# EAGLE design snow_rev_B (EAGLE 5.11)

## Sheet 1 of 3
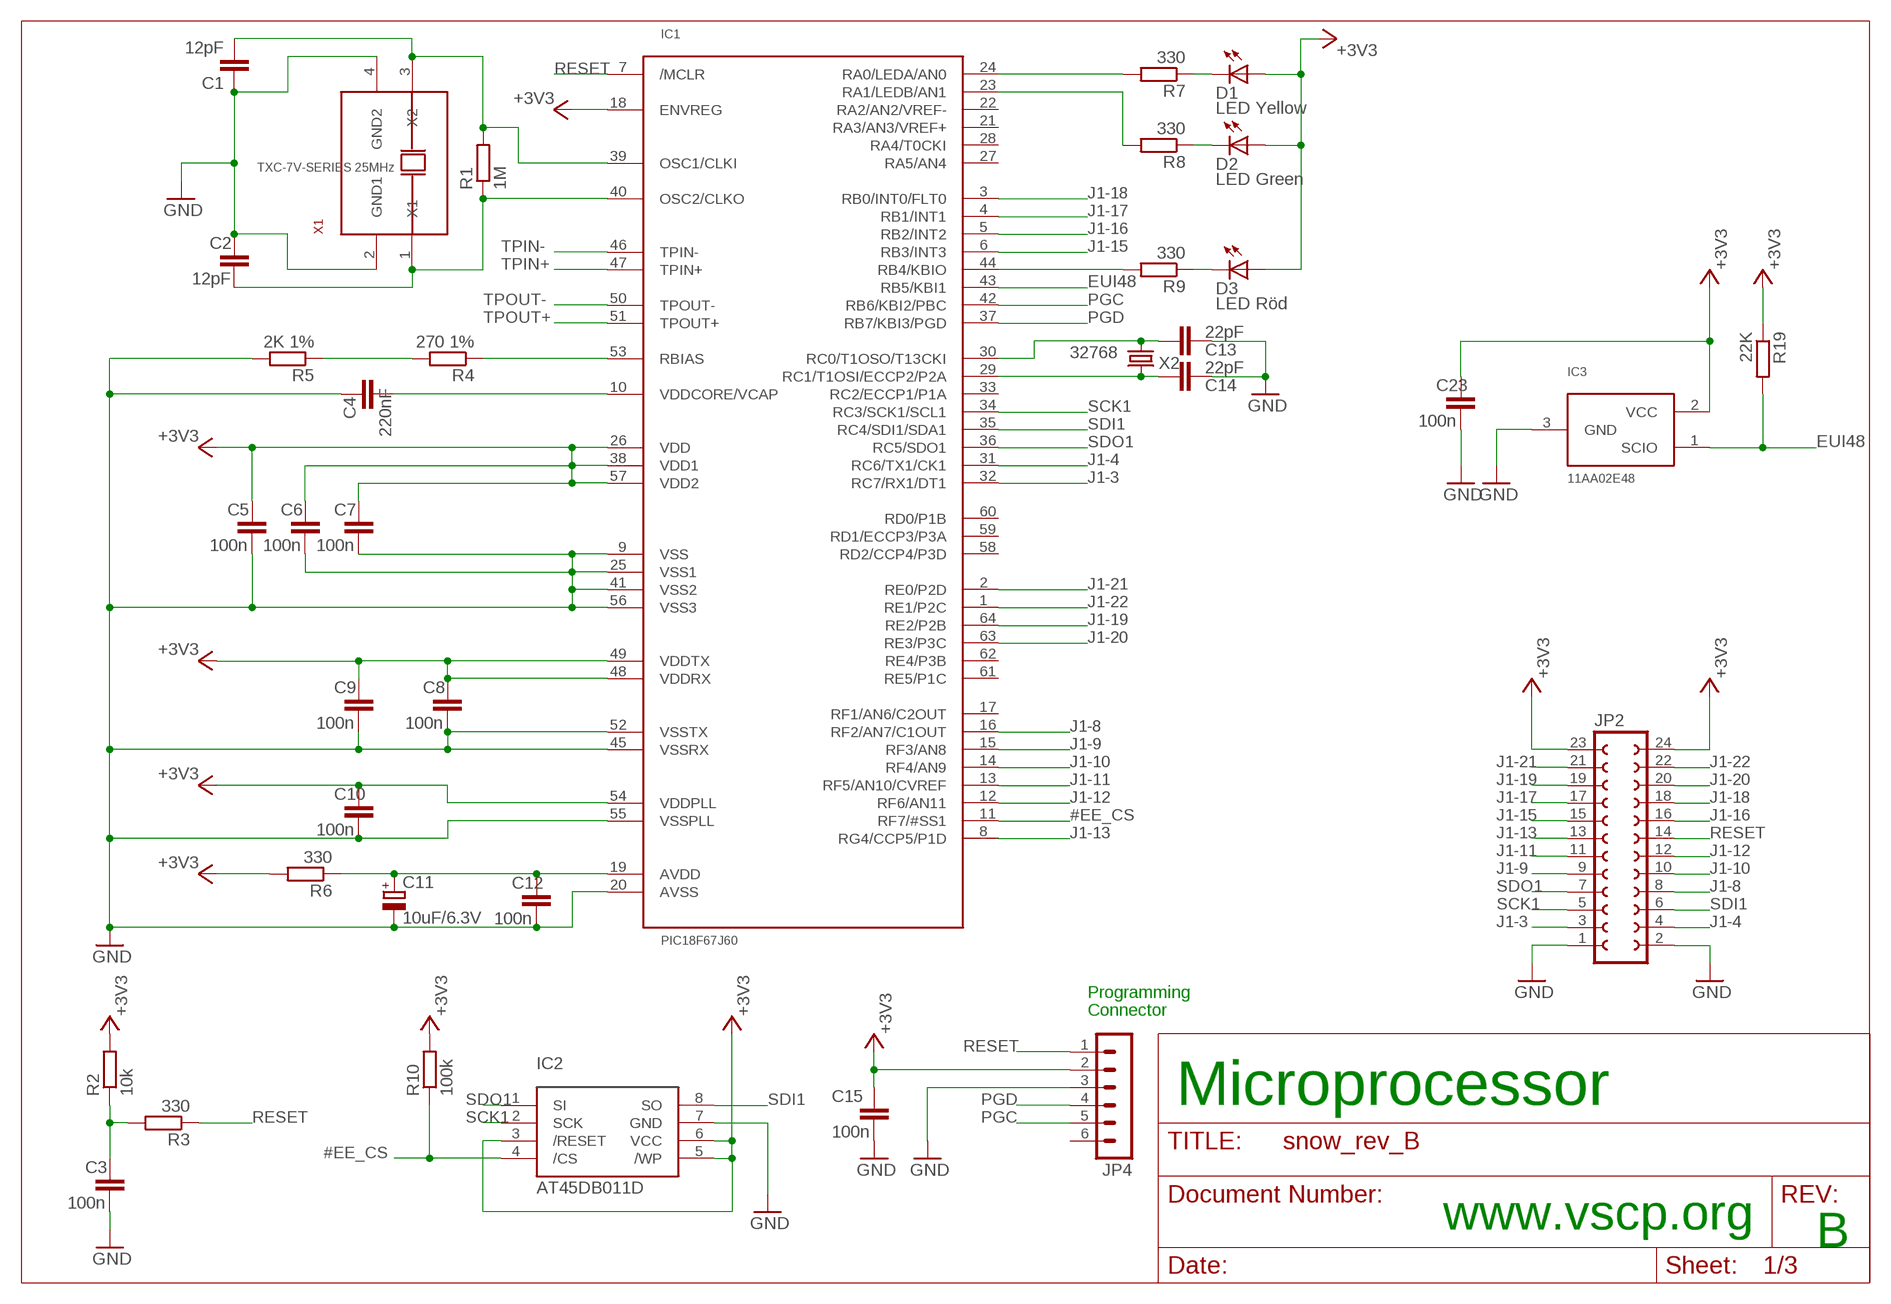
[diagram p0: schematic, sheet 1]

### Parts
C1  12pF  C-EUC0805  [C0805]
C2  12pF  C-EUC0805  [C0805]
C3  100n  C-EUC0805  [C0805]
C4  220nF  C-EUC0805  [C0805]
C5  100n  C-EUC0805  [C0805]
C6  100n  C-EUC0805  [C0805]
C7  100n  C-EUC0805  [C0805]
C8  100n  C-EUC0805  [C0805]
C9  100n  C-EUC0805  [C0805]
C10  100n  C-EUC0805  [C0805]
C11  10uF/6.3V  CPOL-EUSMCP  [SMC_P]
C12  100n  C-EUC0805  [C0805]
C13  22pF  C-EUC0805  [C0805]
C14  22pF  C-EUC0805  [C0805]
C15  100n  C-EUC0805  [C0805]
C23  100n  C-EUC0805  [C0805]
D1  LED Yellow  LED_2012  [C2012]
D2  LED Green  LED_2012  [C2012]
D3  LED Röd  LED_2012  [C2012]
IC1  PIC18F67J60  [TQFP64-10X10]
IC2  AT45DB011D  AT45DB011DSOP8W  [SOP8W]
IC3  11AA02E48  [SOT23]
JP2  FE12-2  [FE12-2]
JP4  MA06-1  [MA06-1]
R1  1M  R-EU_M0805  [M0805]
R2  10k  R-EU_M0805  [M0805]
R3  330  R-EU_M0805  [M0805]
R4  270 1%  R-EU_M0805  [M0805]
R5  2K 1%  R-EU_M0805  [M0805]
R6  330  R-EU_M0805  [M0805]
R7  330  R-EU_M0805  [M0805]
R8  330  R-EU_M0805  [M0805]
R9  330  R-EU_M0805  [M0805]
R10  100k  R-EU_M0805  [M0805]
R19  22K  R-EU_M0805  [M0805]
X1  TXC-7V-SERIES 25MHz  TXC-7V-SERIES  [TXC-7V-SERIES]
X2  32768  CRYSTALTC26H  [TC26H]

### Nets
#EE_CS: IC1.11(RF7/#SS1) IC2.4(/CS) R10.1
+3V3: C5.1 C6.1 C7.1 C8.1 C9.1 C10.1 C15.1 C23.1 D1.1(A) D2.1(A) D3.1(A) IC1.18(ENVREG) IC1.26(VDD) IC1.38(VDD1) IC1.48(VDDRX) IC1.49(VDDTX) IC1.54(VDDPLL) IC1.57(VDD2) IC2.3(/RESET) IC2.5(/WP) IC2.6(VCC) IC3.2(VCC) JP2.23 JP2.24 JP4.2 R2.2 R6.2 R10.2 R19.1 ; also sheet 2,3
EUI48: IC1.43(RB5/KBI1) IC3.1(SCIO) R19.2
GND: C1.1 C2.1 C3.2 C4.1 C5.2 C6.2 C7.2 C8.2 C9.2 C10.2 C11.- C12.2 C13.1 C14.1 C15.2 C23.2 IC1.9(VSS) IC1.20(AVSS) IC1.25(VSS1) IC1.41(VSS2) IC1.45(VSSRX) IC1.52(VSSTX) IC1.55(VSSPLL) IC1.56(VSS3) IC2.7(GND) IC3.3(GND) JP2.1 JP2.2 JP4.3 R5.2 X1.2(GND1) X1.4(GND2) ; also sheet 2,3
J1-3: IC1.32(RC7/RX1/DT1) JP2.3
J1-4: IC1.31(RC6/TX1/CK1) JP2.4
J1-8: IC1.16(RF2/AN7/C1OUT) JP2.8
J1-9: IC1.15(RF3/AN8) JP2.9
J1-10: IC1.14(RF4/AN9) JP2.10
J1-11: IC1.13(RF5/AN10/CVREF) JP2.11
J1-12: IC1.12(RF6/AN11) JP2.12
J1-13: IC1.8(RG4/CCP5/P1D) JP2.13
J1-15: IC1.6(RB3/INT3) JP2.15
J1-16: IC1.5(RB2/INT2) JP2.16
J1-17: IC1.4(RB1/INT1) JP2.17
J1-18: IC1.3(RB0/INT0/FLT0) JP2.18
J1-19: IC1.64(RE2/P2B) JP2.19
J1-20: IC1.63(RE3/P3C) JP2.20
J1-21: IC1.2(RE0/P2D) JP2.21
J1-22: IC1.1(RE1/P2C) JP2.22
N$3: C1.2 IC1.39(OSC1/CLKI) R1.2 X1.3(X2)
N$4: C2.2 IC1.40(OSC2/CLKO) R1.1 X1.1(X1)
N$5: IC1.53(RBIAS) R4.1
N$6: R4.2 R5.1
N$7: C14.2 IC1.29(RC1/T1OSI/ECCP2/P2A) X2.2
N$8: C3.1 R2.1 R3.2
N$9: C4.2 IC1.10(VDDCORE/VCAP)
N$10: C13.2 IC1.30(RC0/T1OSO/T13CKI) X2.1
N$11: IC1.24(RA0/LEDA/AN0) R7.2
N$12: IC1.23(RA1/LEDB/AN1) R8.2
N$13: IC1.44(RB4/KBIO) R9.2
N$14: D3.2(C) R9.1
N$15: D2.2(C) R8.1
N$16: D1.2(C) R7.1
N$23: C11.+ C12.1 IC1.19(AVDD) R6.1
PGC: IC1.42(RB6/KBI2/PBC) JP4.5
PGD: IC1.37(RB7/KBI3/PGD) JP4.4
RESET: IC1.7(/MCLR) JP2.14 JP4.1 R3.1
SCK1: IC1.34(RC3/SCK1/SCL1) IC2.2(SCK) JP2.5
SDI1: IC1.35(RC4/SDI1/SDA1) IC2.8(SO) JP2.6
SDO1: IC1.36(RC5/SDO1) IC2.1(SI) JP2.7
TPIN+: IC1.47(TPIN+) ; also sheet 3
TPIN-: IC1.46(TPIN-) ; also sheet 3
TPOUT+: IC1.51(TPOUT+) ; also sheet 3
TPOUT-: IC1.50(TPOUT-) ; also sheet 3
Unconnected: IC1.17(RF1/AN6/C2OUT) IC1.21(RA3/AN3/VREF+) IC1.22(RA2/AN2/VREF-) IC1.27(RA5/AN4) IC1.28(RA4/T0CKI) IC1.33(RC2/ECCP1/P1A) IC1.58(RD2/CCP4/P3D) IC1.59(RD1/ECCP3/P3A) IC1.60(RD0/P1B) IC1.61(RE5/P1C) IC1.62(RE4/P3B) JP4.6

### Notes on the sheet
- Programming
- Connector
- Microprocessor
- www.vscp.org
- B

## Sheet 2 of 3
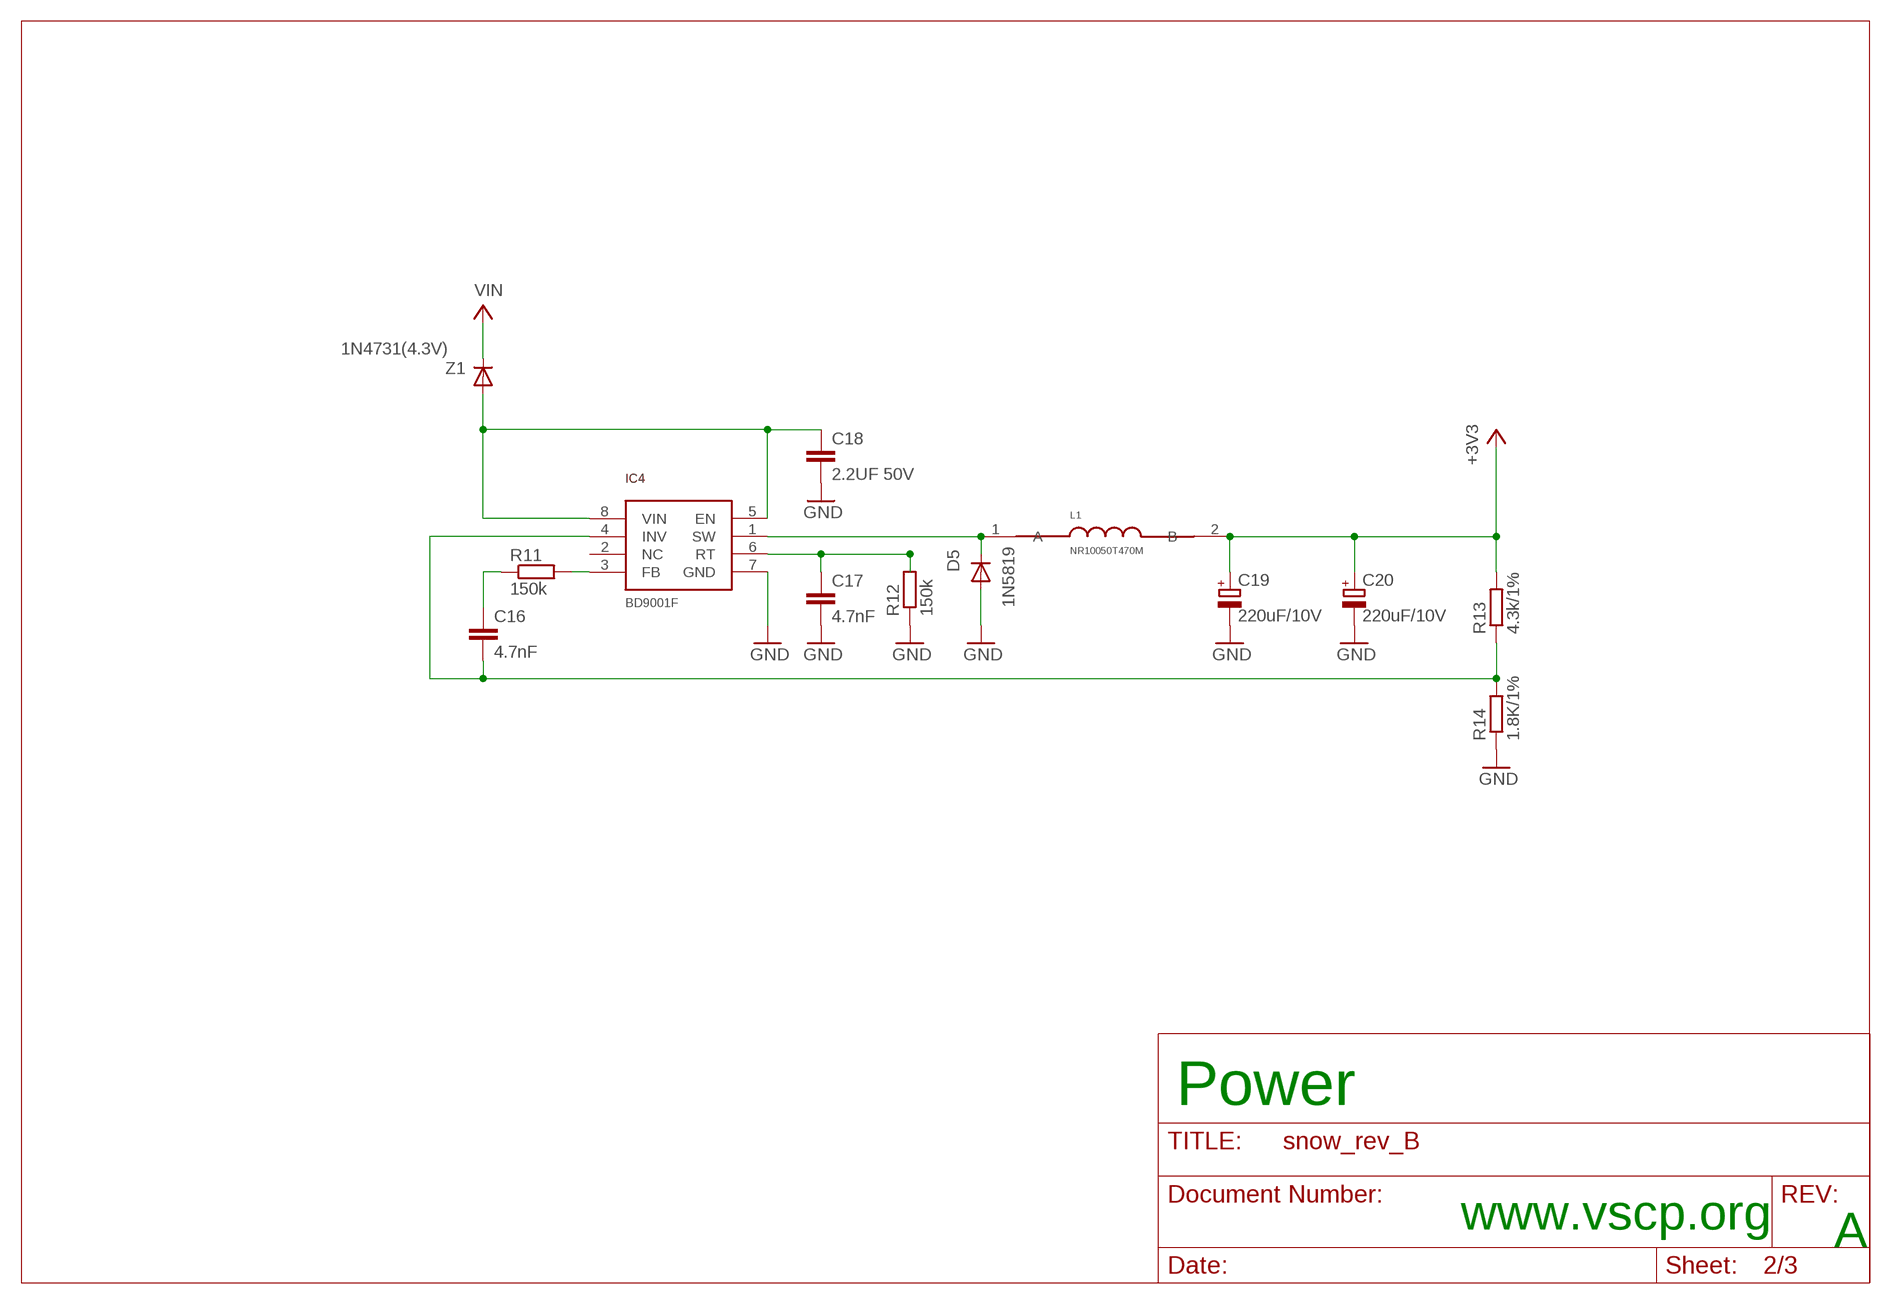
[diagram p1: schematic, sheet 2]

### Parts
C16  4.7nF  C-EUC0805  [C0805]
C17  4.7nF  C-EUC0805  [C0805]
C18  2.2UF 50V  C-EUC2012  [C2012]
C19  220uF/10V  CPOL-EUSMCC  [SMC_C]
C20  220uF/10V  CPOL-EUSMCC  [SMC_C]
D5  1N5819  [SOD-123]
IC4  BD9001F  [SOP8]
L1  NR10050T470M  [NR10050T470M]
R11  150k  R-EU_M0805  [M0805]
R12  150k  R-EU_M0805  [M0805]
R13  4.3k/1%  R-EU_M0805  [M0805]
R14  1.8K/1%  R-EU_M0805  [M0805]
Z1  1N4731(4.3V)  [1N4731]

### Nets
+3V3: C19.+ C20.+ L1.2(B) R13.2 ; also sheet 1,3
GND: C17.2 C18.2 C19.- C20.- D5.A IC4.7(GND) R12.1 R14.1 ; also sheet 1,3
N$17: IC4.3(FB) R11.2
N$18: C16.1 R11.1
N$19: C16.2 IC4.4(INV) R13.1 R14.2
N$20: C17.1 IC4.6(RT) R12.2
N$21: C18.1 IC4.5(EN) IC4.8(VIN) Z1.A
N$22: D5.C IC4.1(SW) L1.1(A)
V+: Z1.C ; supply symbol labelled VIN ; also sheet 3
Unconnected: IC4.2(NC)

### Notes on the sheet
- Power
- www.vscp.org
- A

## Sheet 3 of 3
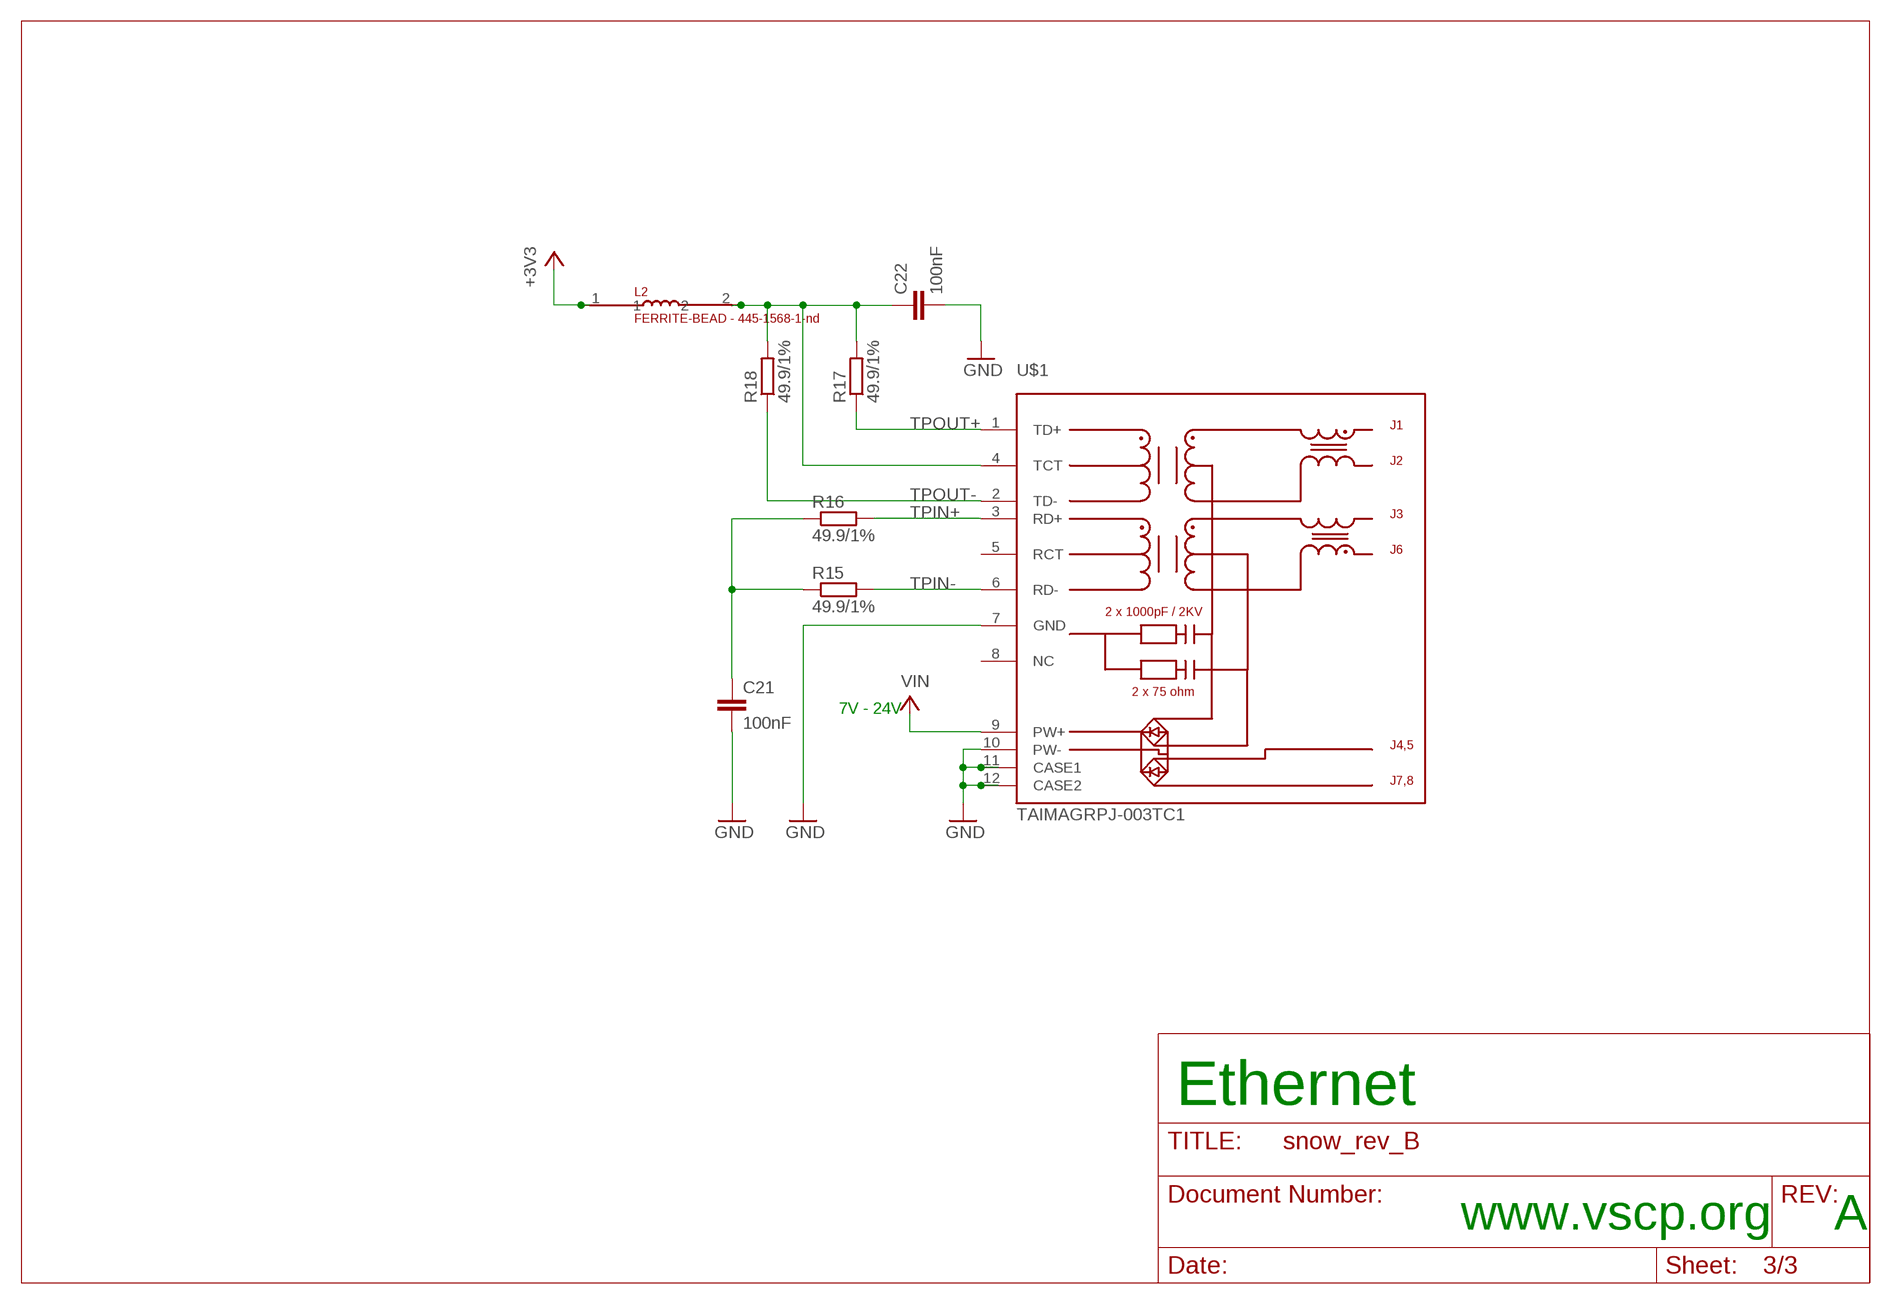
[diagram p2: schematic, sheet 3]

### Parts
C21  100nF  C-EUC0805  [C0805]
C22  100nF  C-EUC0805  [C0805]
L2  FERRITE-BEAD - 445-1568-1-nd  FERRITE-BEAD  [0805]
R15  49.9/1%  R-EU_M0805  [M0805]
R16  49.9/1%  R-EU_M0805  [M0805]
R17  49.9/1%  R-EU_M0805  [M0805]
R18  49.9/1%  R-EU_M0805  [M0805]
U$1  TAIMAGRPJ-003TC1  [TAIMAGRJP-003TC1]

### Nets
+3V3: L2.1 ; also sheet 1,2
GND: C21.2 C22.2 U$1.7(GND) U$1.10(PW-) U$1.11(CASE1) U$1.12(CASE2) ; also sheet 1,2
N$27: C21.1 R15.1 R16.1
N$31: C22.1 L2.2 R17.2 R18.2 U$1.4(TCT)
TPIN+: R16.2 U$1.3(RD+) ; also sheet 1
TPIN-: R15.2 U$1.6(RD-) ; also sheet 1
TPOUT+: R17.1 U$1.1(TD+) ; also sheet 1
TPOUT-: R18.1 U$1.2(TD-) ; also sheet 1
V+: U$1.9(PW+) ; supply symbol labelled VIN ; also sheet 2
Unconnected: U$1.5(RCT) U$1.8(NC)

### Notes on the sheet
- 7V - 24V
- Ethernet
- www.vscp.org | A

## Library data of the parts
C1-C10 C12-C18 C21-C23 = rcl:C-EU: CAPACITOR, European symbol
C11 C19 C20 = rcl:CPOL-EU: POLARIZED CAPACITOR, European symbol
D1-D3 = snow:LED_2012
D5 = snow:1N5819
IC1 = snow:PIC18F67J60
IC2 = snow:AT45DB011D
IC3 = snow:11AA02E48
IC4 = snow:BD9001F
JP2 = con-lsta:FE12-2: FEMALE HEADER; OC_FARNELL: unknown; OC_NEWARK: unknown
JP4 = con-lstb:MA06-1: PIN HEADER; OC_FARNELL: unknown; OC_NEWARK: unknown
L1 = snow:NR10050T470M
L2 = snow:FERRITE-BEAD
R1-R19 = rcl:R-EU_: RESISTOR, European symbol
U$1 = snow:TAIMAGRPJ-003TC1
X1 = snow:TXC-7V-SERIES
X2 = crystal:CRYSTAL: CRYSTAL; OC_FARNELL: unknown; OC_NEWARK: unknown
Z1 = snow:1N4731(4.3V)

## Board
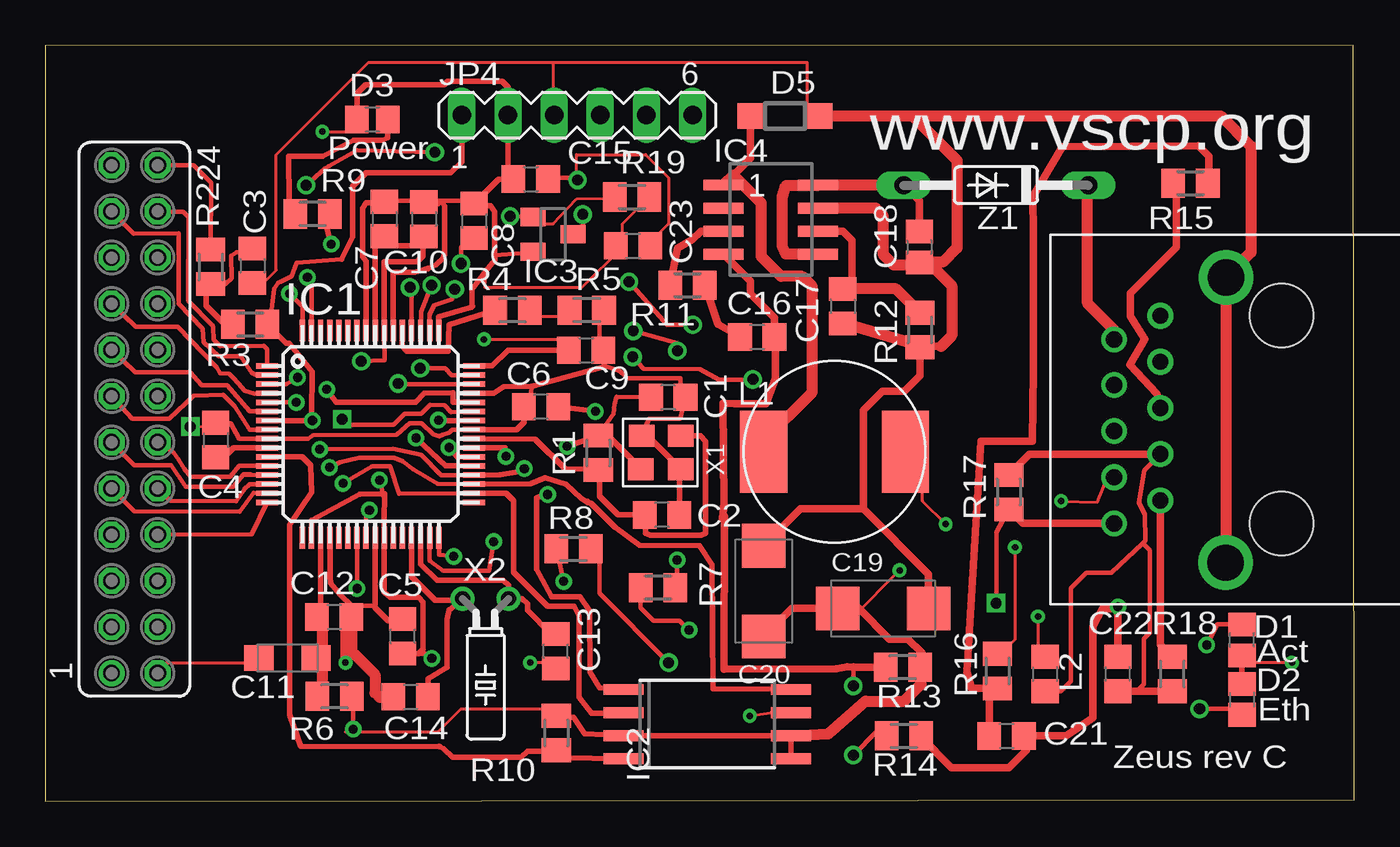
[diagram p3: board, top side]
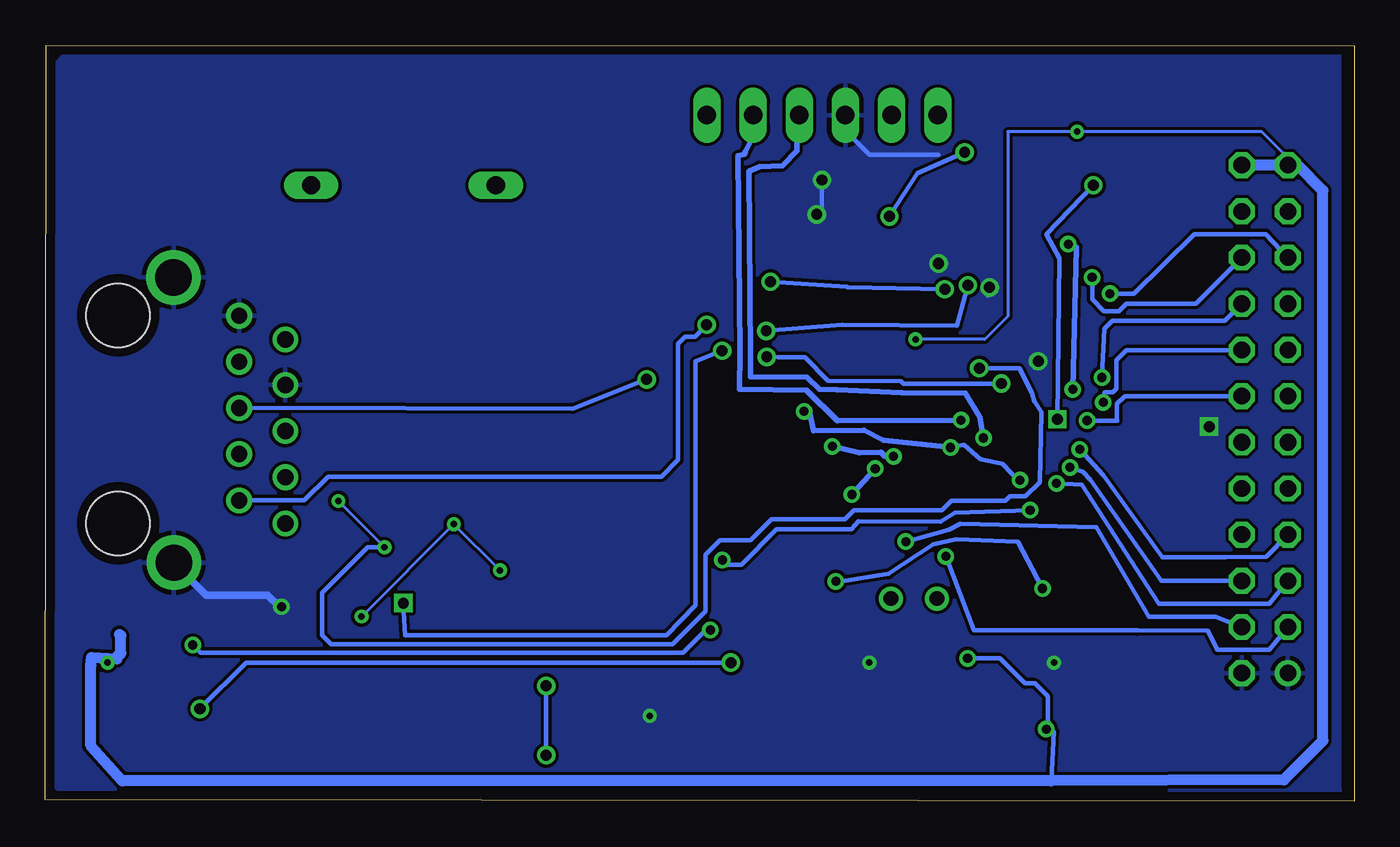
[diagram p4: board, bottom side, seen from below]

Size 72 x 41.57 mm. Coordinates in mm from the lower left corner, seen from the top.
Outline: 0,0 72,0.08 71.95,41.57 0,41.54 0,0
Copper layers (1*16): Top 0.0356mm / dielectric 1.5011mm / Bottom 0.0356mm
Design rules "SilverCircuits": minimum track width 7mil, minimum drill 14mil, track to track 7mil, track to pad 7mil, pad to pad 7mil, via to via 7mil, smd to smd 0mil, copper to edge 20mil, drill to drill 8mil, minimum pad ring 10mil, minimum via ring 8mil, stop-mask expansion 4mil, vias tented up to drill 0mil, thermal gap 10mil

### Footprints (pad centres in the part's own frame; a part is rotated, then mirrored left to right if it is on the bottom)
C0805 = smd 1.3 x 1.5: 1 -0.95,0; 2 0.95,0
SMC_P = smd 1.6 x 1.4: + -1.575,0; - 1.575,0
C2012 = smd 1.3 x 1.5: 1 -0.85,0; 2 0.85,0
SMC_C = smd 2.4 x 2.4: + -2.5,0; - 2.5,0
SOD-123 = smd 1.4 x 1.4: A 1.9,0; C -1.9,0
TQFP64-10X10 = smd 1.2 x 0.3: 1 -5.7,3.75; 2 -5.7,3.25; 3 -5.7,2.75; 4 -5.7,2.25; 5 -5.7,1.75; 6 -5.7,1.25; 7 -5.7,0.75; 8 -5.7,0.25; 9 -5.7,-0.25; 10 -5.7,-0.75; 11 -5.7,-1.25; 12 -5.7,-1.75; 13 -5.7,-2.25; 14 -5.7,-2.75; 15 -5.7,-3.25; 16 -5.7,-3.75; 33 5.7,-3.75; 34 5.7,-3.25; 35 5.7,-2.75; 36 5.7,-2.25; 37 5.7,-1.75; 38 5.7,-1.25; 39 5.7,-0.75; 40 5.7,-0.25; 41 5.7,0.25; 42 5.7,0.75; 43 5.7,1.25; 44 5.7,1.75; 45 5.7,2.25; 46 5.7,2.75; 47 5.7,3.25; 48 5.7,3.75 | smd 0.3 x 1.2: 17 -3.75,-5.7; 18 -3.25,-5.7; 19 -2.75,-5.7; 20 -2.25,-5.7; 21 -1.75,-5.7; 22 -1.25,-5.7; 23 -0.75,-5.7; 24 -0.25,-5.7; 25 0.25,-5.7; 26 0.75,-5.7; 27 1.25,-5.7; 28 1.75,-5.7; 29 2.25,-5.7; 30 2.75,-5.7; 31 3.25,-5.7; 32 3.75,-5.7; 49 3.75,5.7; 50 3.25,5.7; 51 2.75,5.7; 52 2.25,5.7; 53 1.75,5.7; 54 1.25,5.7; 55 0.75,5.7; 56 0.25,5.7; 57 -0.25,5.7; 58 -0.75,5.7; 59 -1.25,5.7; 60 -1.75,5.7; 61 -2.25,5.7; 62 -2.75,5.7; 63 -3.25,5.7; 64 -3.75,5.7
SOP8W = smd 2.2 x 0.6: 1 -4.6,1.905; 2 -4.6,0.635; 3 -4.6,-0.635; 4 -4.6,-1.905; 5 4.6,-1.905; 6 4.6,-0.635; 7 4.6,0.635; 8 4.6,1.905
SOT23 = smd 1 x 1.4: 1 -0.95,-1.1; 2 0.95,-1.1; 3 0,1.1
SOP8 = smd 0.6 x 2.2: 1 -1.905,-2.6; 2 -0.635,-2.6; 3 0.635,-2.6; 4 1.905,-2.6; 5 1.905,2.6; 6 0.635,2.6; 7 -0.635,2.6; 8 -1.905,2.6
FE12-2 = drill 0.914: 1 -13.97,1.27 | drill 0.914 octagon: 2 -13.97,-1.27; 3 -11.43,1.27; 4 -11.43,-1.27; 5 -8.89,1.27; 6 -8.89,-1.27; 7 -6.35,1.27; 8 -6.35,-1.27; 9 -3.81,1.27; 10 -3.81,-1.27; 11 -1.27,1.27; 12 -1.27,-1.27; 13 1.27,1.27; 14 1.27,-1.27; 15 3.81,1.27; 16 3.81,-1.27; 17 6.35,1.27; 18 6.35,-1.27; 19 8.89,1.27; 20 8.89,-1.27; 21 11.43,1.27; 22 11.43,-1.27; 23 13.97,1.27; 24 13.97,-1.27
MA06-1 = drill 1.016 long: 1 -6.35,0; 2 -3.81,0; 3 -1.27,0; 4 1.27,0; 5 3.81,0; 6 6.35,0
NR10050T470M = smd 2.6 x 4.5: 1 -3.9,0; 2 3.9,0
0805 = smd 1.3 x 1.5: 1 -0.95,0; 2 0.95,0
M0805 = smd 1.3 x 1.6: 1 -0.95,0; 2 0.95,0
TAIMAGRJP-003TC1 = drill 0.9: 1 -5.72,9.2; 2 -4.45,6.66; 3 -3.18,9.2; 4 -1.91,6.66; 5 -0.64,9.2; 6 0.63,6.66; 7 1.9,9.2; 8 3.17,6.66; 9 4.4,9.2; 10 5.7,6.66 | drill 2: 11 -7.88,3.07; 12 7.81,3.05 | hole 3.5: -5.72,0; 5.72,0
TXC-7V-SERIES = smd 1.4 x 1.2: 1 -1.07,-0.67; 2 1.07,-0.67; 3 1.13,1.17; 4 -1.07,1.17
TC26H = drill 0.813: 1 -1.27,0; 2 1.27,0
1N4731 = drill 1 long: A 5.08,0; C -5.08,0

### Placement (x,y rotation side)
C1  34.27,22.21 180 top
C2  33.92,15.75 180 top
C3  11.39,29.45 270 top
C4  9.37,19.87 270 top
C5  19.65,9.07 90 top
C6  27.27,21.69 180 top
C7  18.65,32.02 270 top
C8  23.59,31.92 270 top
C9  29.75,24.81 0 top
C10  20.82,32.01 270 top
C11  13.32,7.88 180 top
C12  15.89,10.14 0 top
C13  28.08,8.25 90 top
C14  20.09,5.74 0 top
C15  26.7,34.22 0 top
C16  39.16,25.54 0 top
C17  43.87,27.23 270 top
C18  48.08,30.48 270 top
C19  46.09,10.6 0 top
C20  39.52,11.56 90 top
C21  52.88,3.59 0 top
C22  59,7 90 top
C23  32.32,30.55 0 top
D1  65.83,8.87 90 top
D2  65.83,5.6 270 top
D3  17.99,37.5 0 top
D5  40.69,37.69 0 top
IC1  17.89,20.19 0 top
IC2  36.41,4.24 0 top
IC3  27.93,31.18 270 top
IC4  39.91,31.99 270 top
JP2  4.91,21.01 90 top
JP4  29.25,37.73 0 top
L1  43.42,19.22 0 top
L2  55,7 270 top
R1  30.42,19.16 90 top
R2  9.09,29.39 90 top
R3  11.26,26.22 180 top
R4  25.69,27 0 top
R5  29.79,27.01 0 top
R6  15.9,5.77 0 top
R7  33.7,11.75 0 top
R8  29.05,13.88 180 top
R9  14.7,32.3 0 top
R10  28.11,3.75 90 top
R11  35.33,28.39 180 top
R12  48.12,25.92 90 top
R13  47.17,7.36 0 top
R14  47.23,3.59 180 top
R15  63,34 180 top
R16  52.38,7.16 90 top
R17  53,17 90 top
R18  62,7 270 top
R19  32.27,33.23 180 top
U$1  68,21 90 top
X1  33.89,19.43 180 top
X2  24.21,11.15 180 top
Z1  52.3,33.88 180 top

### Tracks (layer width: path | path; a pad name or v marks a point on that pad's centre or on a via)
#EE_CS
  Top 0.305: IC2.4 28.35,2.39 R10.1 28.11,2.77 28.09,2.75 26.53,2.75 26.18,2.41 22.41,2.41 21.92,2.9 21.67,3.02 21.7,3 14.04,3.02 13.42,4.75 13.42,15.19 14.64,16.98 14.58,18.47 14.12,18.93 IC1.11
+3V3  (via drill 0.36, 0.5)
  Top 0.178: R10.2 27.94,5.08 22.86,5.08 21.59,3.81 16.51,3.81 v16.94,3.97 | 26.54,30.16 IC3.2 | C8.1 24,32.7 | 31.75,30.48 31.75,31.75 33.02,33.02 R19.1 | 31.75,30.48 29.52,28.27 24.17,28.27 24.2,29.14 | 31.75,30.48 C23.1 | v54.61,10.16 54.61,7.62 L2.1 | v49.53,15.24 48.26,16.51 48.26,19.05 L1.2 | v68.58,7.62 66.04,7.62 D1.1 | v15.24,36.83 16.51,36.83 D3.1 | v24.13,25.4 29.21,25.4 C9.1 | v46.99,12.7 44.45,10.16 C19.+
  Top 0.254: R2.2 9.12,34.01 8.15,34.98 JP2.24 | C5.1 21,8.12 v21.26,7.86 | v16.94,3.97 16.94,5.69 R6.2 | v18.38,17.66 18.63,16.68 18.66,16.9 | C7.1 19.05,33.02 20.32,33.02 C10.1 | 21.59,32.96 21.59,33.02 22.86,33.02 C8.1 | 24.71,30.04 26.54,30.16
  Top 0.305: IC1.57 17.64,29.69 17.46,29.94 17.46,32.62 17.66,32.92 18.59,32.92 C7.1 | 21.51,32.96 21.59,32.96 21.82,32.96 21.96,32.74 21.97,30.08 21.88,29.86 21.48,29.5 21.05,29.29 21.05,29.32 20.31,29.1 19.14,29.1 19.13,28.61 19.13,25.93 IC1.54 | 21.51,32.96 C10.1 | IC1.49 21.62,26.63 23.34,27.14 23.45,27.17 23.45,27.23 23.49,27.23 23.47,27.21 23.47,28.17 24.2,29.14 24.73,29.78 24.71,30.04 24.71,32.41 24.5,32.76 23.7,32.76 C8.1 24.94,34.22 C15.1 25.44,34.53 JP4.2 25.46,37.75 25.46,39.26 25.11,39.61 22.14,39.61 21.93,39.4 17.61,39.4 17.14,38.93 D3.1 | IC1.48 24.58,23.94 25.46,24.82 C9.1 | IC1.38 22.64,18.94 v22.21,19.46 | v30.26,21.45 C6.1 | C5.1 20.52,8.12 20.77,8.37 20.77,10.96 20.52,11.21 18.96,11.21 18.63,11.49 18.63,14.48 IC1.26 18.64,15.44 18.66,16.9 17.28,16.88 14.64,15.45 IC1.18 | R10.2 28.2,4.61 29.06,4.61 29.67,3.71 IC2.3 IC2.6 IC2.5 | 21.51,32.96 21.61,32.87 | D1.1 D2.1 | D1.1 | 48.18,6.44 48.18,7.3 R13.2
  Top 0.406: 48.09,7.39 R13.2 48.21,7.45 48.21,8.18 47.47,8.92 46.44,8.92 44.76,10.6 C19.+ 41.06,10.6 C20.+
  Top 0.61: IC2.6 43.08,3.71 45.12,5.5 47.24,5.5 48.18,6.44
  Bottom 0.178: v54.61,10.16 v49.53,15.24 v46.99,12.7 | 68.57,7.86 v68.58,7.62 | JP2.23 3.81,35.56 5.08,36.83 v15.24,36.83 19.05,36.83 19.05,26.67 20.32,25.4 v24.13,25.4
  Bottom 0.254: v21.26,7.86 19.49,7.86 18.11,6.48 17.56,6.48 R6.2 16.86,4.05 v16.94,3.97 16.51,3.81 16.66,1.12 | v22.21,19.46 21.45,19.6 20.55,18.81 19.34,18.56 18.31,17.45 v18.38,17.66
  Bottom 0.305: v22.21,19.46 25.91,19.85 26.97,20.41 29.73,20.38 29.96,21.45 29.94,21.44 v30.26,21.45
  Bottom 0.61: JP2.24 JP2.23 3.11,34.98 1.71,33.59 1.71,3.33 3.87,1.17 16.66,1.12 67.76,1.12 69.5,3.06 69.5,7.47 69.46,7.91 68.57,7.86 68.06,7.83 68.06,7.95 67.96,8.05 67.94,8.05 67.88,8.11 67.88,8.12 67.86,8.15 67.86,9.11 67.93,9.18
EUI48  (via drill 0.6)
  Top 0.178: IC3.1 26.67,31.75 27.94,31.75 29.23,33.13 31.76,33.16 R19.2
  Top 0.254: IC1.43 22.32,21.41 21.95,21.77 21.17,21.81 20.67,21.31 19.76,21.31 19.15,20.7 16.63,20.7 v16.32,21 | v14.34,33.88 15.39,34.82 15.59,34.92 17.15,35.8 v21.42,35.69 | v25.56,32.17 IC3.1
  Bottom 0.254: v16.32,21 16.22,29.87 16.92,31.17 v14.34,33.88 | v21.42,35.69 24.02,34.55 v25.56,32.17
GND  (via drill 0.36, 0.5, 0.6, 0.61)
  Top 0.178: C12.2 16.51,10.16 | 27.94,40.64 17.78,40.64 12.7,35.56 12.7,29.21 11.43,27.94 C3.2 | 27.94,40.64 27.94,38.1 JP4.3 | C23.2 33.02,30.48 34.29,31.75 34.29,34.29 33.02,35.56 29.21,35.56 29.21,34.29 v29.28,34.17 | 27.94,40.64 41.91,40.64 41.91,38.1 D5.A | v26.67,7.62 27.94,7.62 C13.1 | C11.- 11.43,7.62 6.35,7.62 JP2.2 | v38.75,4.7 39.9,4.87 IC2.7 | C4.1 8.81,20.56 v7.97,20.61
  Top 0.254: X1.2 33.21,21.04 34.91,21.04 34.95,21.08 C1.1 34.9,22.21 34.95,23.28 32.04,23.28 31.92,23.37 31.61,23.64 31.56,23.69 30.89,23.89 30.73,23.89 | 16.84,10.74 18.13,10.74 18.14,10.72 | 16.84,8.07 17.03,8.07 | 18.39,5.69 19.09,5.69 C14.1 | C4.1 9.36,20.78 10.18,20.78 10.64,19.94 IC1.9 14.46,19.94 14.73,20.13 19.33,20.14 20.05,20.8 20.7,20.8 21.33,20.17 21.66,20.07 21.86,20.16 22.2,20.26 22.37,20.43 23.57,20.42 IC1.41 | C9.2 30.48,25.4 30.48,26.67 R5.2 | 26.73,22.82 26.67,21.59 C6.2 | v22.86,29.58 22.86,30.48 C8.2 | C15.2 27.94,34.29 29.16,34.29 v29.28,34.17 | v29.57,32.28 29.57,31.72 IC3.3 | IC1.52 20.14,27.75 v20.06,28.26 | IC1.55 18.65,24.26 17.31,24.2 v17.38,24.2
  Top 0.305: C2.1 34.87,18.18 X1.4 33.12,20.1 X1.2 | 18.14,30.56 IC1.56 | 18.14,30.56 C7.2 | IC1.55 18.64,25.57 18.63,25.53 18.63,28.85 18.62,29.68 20.45,29.68 20.78,30 20.78,31.02 C10.2 | IC1.41 25.92,20.44 26.33,20.85 C6.2 | IC1.45 24.67,22.44 25.2,22.8 26.73,22.82 26.89,22.85 30.73,23.89 30.73,24.78 C9.2 | IC1.25 18.14,10.72 18.14,10.63 18.84,9.93 19.57,9.93 C5.2 | C12.2 16.84,10.74 16.21,11.37 15.7,11.99 15.66,12.37 15.66,14.47 IC1.20 | C10.2 20.91,30.97 | 18.14,30.56 20.32,30.56 C10.2 | JP4.3 28,37.75
  Top 0.406: C22.2 v59,10.69 v59.01,10.7 58.89,10.59 58.16,10.59 57.63,9.59 57.63,4.59 56.16,3.59 C21.2 53.97,3.46 53.97,2.81 53.01,1.85 49.86,1.85 48.18,3.53 R14.1 | 47.93,29.48 C18.2 48.59,29.63 48.61,29.65 | 49.29,25.02 48.17,25.02 R12.1 | R12.1 48.01,25.07 | D5.A 47.71,37.69 | 45,16.09 45,21.5 46.05,22.55 47.25,22.55 48.1,23.4 48.1,24.95 R12.1 | 45,16.09 41.55,16.09 C20.- | C19.- 48.59,12.49 45,16.09
  Top 0.61: U$1.11 U$1.12 66.33,30.19 66.33,36.03 64.67,37.69 D5.A | IC4.7 45.67,32.62 46.1,32.2 46.1,30.07 46.68,29.48 47.93,29.48 | 48.59,29.63 49.87,28.36 49.87,25.6 49.29,25.02 | 48.01,25.07 C17.2 | 47.71,37.69 50.15,35.24 50.15,30.43 49.37,29.65 48.61,29.65 | C12.2 16.84,8.07 | 17.03,8.07 18.13,6.96 18.13,5.95 18.39,5.69 | 16.51,10.16 v16.51,7.62
  Bottom 0.254: 22.86,35.56 26.67,35.56 27.94,36.83 JP4.3 | v29.28,34.17 29.28,32.56 v29.57,32.28 | v20.06,28.26 20.15,27.8 20.16,27.82 | v17.38,24.2 17.39,24.16
  Bottom 0.406: v59.01,10.7 59.12,10.7 59.76,11.33 63.14,11.33 U$1.11
  pour Bottom: 0.82,41.27 0.82,0.67 0.75,0.6 71.25,0.6 71.55,0.9 71.55,40.44 70.88,41.11 1.05,41.11
J1-3  (via drill 0.5)
  Top 0.254: IC1.32 21.66,13.55 v22.46,13.47
  Bottom 0.254: v22.46,13.47 20.92,9.41 11.93,9.4 8.04,9.39 7.51,8.33 4.66,8.33 JP2.3
J1-4  (via drill 0.5)
  Top 0.254: v24.66,14.28 24.41,12.69 21.88,12.69 21.13,13.23 IC1.31
  Bottom 0.254: JP2.4 7.62,10.16 11.29,10.15 14.19,15.07 21.66,15.25 22.28,14.93 v24.66,14.28
J1-8
  Top 0.254: IC1.16 11.34,14.69 JP2.8
J1-9
  Top 0.254: IC1.15 11.45,16.96 10.7,15.93 4.88,15.95 JP2.9
J1-10
  Top 0.254: IC1.14 11.23,17.44 10.94,17.16 10.94,17.13 10.51,16.5 6.85,16.53 JP2.10
J1-11
  Top 0.254: IC1.13 10.94,17.96 11.29,17.98 10.92,17.98 10.33,17.28 7.71,17.28 6.92,18.49 4.89,18.49 JP2.11
J1-12
  Top 0.254: IC1.12 10.67,18.44 10.17,17.85 8,17.85 7.63,18.3 7.32,18.79 7.04,19.15 6.2,19.73 JP2.12
J1-13
  Top 0.254: IC1.8 11.23,20.43 10.4,21.73 10.05,22.07 9.78,22.35 8.15,22.29 6.82,21.04 4.77,21.05 JP2.13
J1-15
  Top 0.254: IC1.6 11.23,21.45 9.99,22.89 8.6,22.89 7.97,23.58 4.95,23.58 JP2.15
J1-16  (via drill 0.5)
  Top 0.254: IC1.5 13.73,21.94 v13.8,21.93
  Bottom 0.254: v13.8,21.93 13.74,22.47 13.7,22.5 13.27,22.5 13.09,22.68 13.09,24.25 12.54,24.8 6.2,24.8 JP2.16
J1-17
  Top 0.254: IC1.4 11.51,22.4 10.96,22.58 10.63,22.95 10.32,23.28 10.1,23.52 9.6,23.54 9.43,23.88 7.27,26.09 4.96,26.1 JP2.17
J1-18  (via drill 0.5)
  Top 0.254: IC1.3 13.23,22.94 v13.88,23.31
  Bottom 0.254: v13.88,23.31 13.74,25.98 13.29,26.43 7.11,26.43 JP2.18
J1-19  (via drill 0.5)
  Top 0.254: IC1.64 14.14,27.2 v13.43,27.91
  Bottom 0.254: v13.43,27.91 12.12,27.91 8.79,31.2 4.85,31.2 JP2.19
J1-20  (via drill 0.5)
  Top 0.254: IC1.63 14.64,28.59 v14.41,28.81
  Bottom 0.254: v14.41,28.81 14.41,27.6 13.76,26.95 12.95,26.95 12.53,27.37 8.71,27.37 JP2.20
J1-21
  Top 0.254: IC1.2 11.62,23.44 11.35,23.55 10.75,24.48 9.53,24.47 8.72,25.23 8.65,25.99 7.33,27.35 7.33,31.25 4.85,31.21 JP2.21
J1-22
  Top 0.254: IC1.1 12.19,24.86 12,25.05 9.62,25.02 9.25,25.39 9.24,26.04 9.2,26.19 9.21,26.16 7.84,27.53 7.89,32.11 7.57,32.43 JP2.22
N$3  (via drill 0.5)
  Top 0.254: R1.2 31.26,21.32 31.31,21.84 31.42,22.24 C1.2
  Top 0.305: X1.3 32.76,18.3 30.99,20.07 30.46,20.07 R1.2 30.37,20.07 v28.7,19.52 | IC1.39 25.3,19.44 v25.34,18.97
  Bottom 0.305: v25.34,18.97 25.82,18.97 26.04,19.19 27.22,19.16 v28.7,19.52
N$4
  Top 0.305: X1.1 36.03,20.1 36.32,19.81 36.32,14.73 36.08,14.63 33.29,14.63 33.02,14.73 33.02,15.7 C2.2 31.5,15.75 30.48,16.76 30.48,18.15 R1.1 30.34,18.29 28.6,18.26 26.93,19.91 IC1.40
N$5
  Top 0.305: R4.1 22.21,26.22 22.15,24.74 19.87,24.74 19.62,25.02 19.62,25.88 IC1.53
N$6
  Top 0.178: R4.2 26.67,26.67 29.21,26.67 R5.1
N$7
  Top 0.305: IC1.29 20.14,12.36 21.43,11.07 22.86,11.07 X2.2 22.31,10.6 22.2,10.54 22.11,10.02 22.11,7.37 21.04,6.75 C14.2
N$8
  Top 0.254: R2.1 9.89,28.44 10.24,28.76 10.23,30 10.51,30.21 11.07,30.21 C3.1
  Top 0.305: R3.2 9.86,26.22 8.84,27.25 8.84,28.64 R2.1
N$9
  Top 0.305: IC1.10 10.35,19.44 10.05,19.14 9.12,19.14 C4.2
N$10
  Top 0.305: IC1.30 20.64,13.04 21.54,12.14 25.19,12.14 25.47,11.87 25.47,11.16 X2.1 25.5,11.14 26.24,11.14 26.51,10.86 26.51,10.51 27.83,9.2 C13.2
N$11  (via drill 0.5)
  Top 0.254: IC1.24 17.64,15.7 v17.82,16.01 | v34.75,13.27 34.75,11.85 R7.2
  Bottom 0.254: v17.82,16.01 21.97,15.88 22.75,15.38 27.28,15.39 27.66,14.95 31.77,14.96 33.71,13.02 34.5,13.02 v34.75,13.27
N$12  (via drill 0.5)
  Top 0.254: IC1.23 v17.14,11.71 v17.15,11.7 | v28.51,12.1 28.11,13.9 R8.2
  Bottom 0.254: v17.15,11.7 18.49,14.28 21.89,14.41 23.13,14.13 25.61,12.51 28.33,12.08 v28.51,12.1
N$13  (via drill 0.5)
  Top 0.305: IC1.44 22.43,21.96 22.43,22.46 20.82,22.44 20.37,21.95 16,21.94 v15.48,22.65 | v15.72,30.64 15.29,32.27 R9.2
  Bottom 0.305: v15.48,22.65 15.27,30.47 v15.72,30.64
N$14
  Top 0.305: R9.1 13.4,32.96 13.38,35.47 15.24,35.47 16.95,36.36 18.06,36.36 18.33,36.35 18.56,36.35 18.82,36.51 D3.2
N$15  (via drill 0.61)
  Top 0.254: v63.5,5.08 66.04,5.08 D2.2 | v34.29,7.62 30.48,11.43 30.48,13.97 R8.1
  Bottom 0.254: v63.5,5.08 60.96,7.62 v34.29,7.62
N$16  (via drill 0.5)
  Top 0.254: R7.1 32.75,10.65 33.46,9.94 34.89,9.94 v35.41,9.42 | v63.89,8.59 64.48,9.74 D1.2
  Bottom 0.254: v35.41,9.42 35.67,9.42 36.93,8.16 63.45,8.16 v63.89,8.59
N$17
  Top 0.406: IC4.3 36.06,31.36 35.58,30.87 34.77,30.42 R11.2
N$18
  Top 0.406: C16.1 37,26.24 R11.1
N$19  (via drill 0.61)
  Top 0.254: v44.45,2.54 45.72,3.81 R14.2 | v44.45,6.35 44.45,7.48 44.12,7.39
  Top 0.406: R13.1 44.54,7.36 44.12,7.39 43.51,7.29 37.33,7.27 37.36,15.66 37.26,15.56 37.32,16.35 37.28,21.88 37.9,21.85 39.64,21.85 40.18,23.28 40.18,25.47 C16.2 40.11,26.59 38.79,27.91 38.79,28.6 IC4.4
  Bottom 0.254: v44.45,6.35 v44.45,2.54
N$20
  Top 0.406: IC4.6 43.88,31.36 44.39,30.85 44.39,28.7 C17.1
  Top 0.61: C17.1 46.8,28.18 R12.2
N$21
  Top 0.406: 47.2,33.9 Z1.A 48.08,33.02 C18.1 | 42.48,33.87 IC4.8
  Top 0.61: IC4.8 47.2,33.9 | IC4.5 40.73,30.09 40.55,30.53 40.55,33.24 40.75,33.87 42.48,33.87
N$22
  Top 0.406: D5.C 38.79,35.37 37.85,34.44 | L1.1 39.52,19.83
  Top 0.61: IC4.1 37.85,34.44 39.39,32.9 39.39,29.95 40.47,28.87 41.64,28.87 42.19,28.32 42.19,22.5 39.52,19.83
N$23
  Top 0.178: R6.1 15.24,6.35 | 15.24,7.62 C11.+ | 15.24,10.16 C12.1
  Top 0.305: IC1.19 15.14,10.34 C12.1 | R6.1 15.03,5.85
  Top 0.61: 15.24,6.35 15.24,7.62 15.24,10.16
N$27
  Top 0.406: C21.1 51.93,5.76 R16.1 50.94,6.21 50.69,7.13 51.46,19.79 54.3,19.79 54.36,23.7 54.37,31.89 54.3,33.23 55.94,36 63.42,36.04 64,35.47 64,34.05 R15.1
N$31
  Top 0.254: L2.2 55.86,6.05 56.42,6.61 56.42,11.71 57.28,12.57 58.65,12.57 60.37,14.18 | 60.37,14.18 60.51,14.32 60.48,15.79 60.15,16.41 60.46,18.21 U$1.4 | C22.1 60.04,6.05 60.42,6.44 60.42,8.94 60.76,9.28 60.76,13.79 60.37,14.18
  Top 0.406: U$1.4 54.14,19.09 R17.2 | C22.1 R18.2
PGC  (via drill 0.5)
  Top 0.305: IC1.42 21.66,20.94 v21.63,20.96
  Bottom 0.305: v21.63,20.96 28.42,20.93 30.12,22.61 33.81,22.65 33.77,24.71 33.9,35.49 33.54,35.59 33.49,35.74 33.11,36.44 33.11,37.68 JP4.5
PGD  (via drill 0.5)
  Top 0.305: IC1.37 22.02,18.44 v20.39,19.98
  Bottom 0.305: v20.39,19.98 20.58,21.11 21.38,22.44 24.87,22.47 28.45,22.64 29.42,22.65 30.1,23.32 33.22,23.35 33.21,24.41 33.28,34.65 32.72,34.9 31.45,34.95 30.66,35.78 30.66,37.6 JP4.4
RESET  (via drill 0.5)
  Top 0.254: 16.29,29.8 13.81,29.61 13.55,28.87 12.94,28.57 12.82,28.5 12.59,28.18 12.37,26.38 R3.1 | v14.69,20.94 14.58,21.25 14.65,21.27
  Top 0.305: IC1.7 13.25,20.94 v14.69,20.94 14.65,21.27 14.66,23.63 13.4,25.2 13.24,25.2 R3.1 | 16.29,29.8 16.91,31.04 16.91,33.83 17.64,34.56 22.3,34.56 22.93,35.18 22.93,37.7 JP4.1
  Bottom 0.254: JP2.14 12.62,22.28 13.04,21.86 13.04,20.95 13.03,20.94 14.42,20.94 v14.69,20.94
SCK1  (via drill 0.5)
  Top 0.254: IC1.34 19.46,16.9 18.98,18.44 17.98,18.43 v16.38,17.49
  Top 0.305: IC1.34 25.34,16.94 25.75,16.53 25.75,12.6 27.63,10.72 29.09,10.72 29.37,10.2 29.37,5.71 30.06,4.84 31.48,4.84 IC2.2
  Bottom 0.254: v16.38,17.49 14.98,17.4 10.74,10.87 4.67,10.87 JP2.5
SDI1  (via drill 0.5)
  Top 0.254: IC1.35 21.59,17.45 20.23,18.26 19.64,18.69 19.19,18.88 17.25,18.9 16.21,18.64 16.16,18.61 v15.63,18.37
  Top 0.305: IC1.35 26.7,17.45 27.48,17.79 28.64,17.43 29.47,16.67 29.85,16.4 29.84,16.49 30.03,16.39 31.35,15.07 31.32,15.09 32.68,14.09 35.98,14.06 36.67,13.02 36.72,6.18 IC2.8
  Bottom 0.254: v15.63,18.37 14.93,18.12 14.49,17.68 10.61,12.12 JP2.6
SDO1  (via drill 0.5)
  Top 0.254: IC1.36 21.87,17.94 21.77,17.94 20.66,19.05 19.13,19.38 v15.09,19.36
  Top 0.305: IC2.1 30.48,6.25 29.96,7.1 29.95,10.48 29.43,11.26 27.85,11.26 27.01,12.75 27.01,16.68 v27.63,16.87 | v26.35,18.29 26.04,18.12 25,17.95 23.6,17.93 IC1.36
  Bottom 0.254: v15.09,19.36 13.81,17.93 10.55,13.41 7.06,13.41 4.83,13.44 JP2.7
  Bottom 0.305: v26.35,18.29 v27.63,16.87
TPIN+  (via drill 0.36, 0.6)
  Top 0.178: v53.34,13.97 53.34,8.89 52.07,7.62 R16.2 | v55.88,16.51 57.89,16.45 58.42,17.78 U$1.3
  Top 0.254: v20.62,23.81 21.98,23.81 22.34,23.44 IC1.47
  Bottom 0.178: v53.34,13.97 v55.88,16.51
  Bottom 0.254: v53.34,13.97 54.28,13.97 56.78,11.46 56.78,9.12 56.29,8.63 37.5,8.63 35.69,10.44 35.69,13.54 34.89,14.34 33.21,14.34 32.06,15.5 28.01,15.5 27.52,15.99 22.69,15.99 22.15,16.53 19.17,16.53 18.92,16.78 18.07,16.78 17.29,17.56 17.21,21.39 17.55,21.96 17.58,21.98 17.73,22.46 18.43,23.81 20.22,23.81 v20.62,23.81
TPIN-  (via drill 0.6)
  Top 0.254: IC1.46 19.15,22.94 v19.41,22.97 | v32.31,24.44 32.34,24.42 32.91,23.78 36,23.76 37.05,23.2 38.35,23.2 v38.92,23.2
  Top 0.406: U$1.6 61.14,22.4 59.65,24.01 60.48,25.4 59.69,26.67 59.69,27.94 62.23,30.48 62.23,33.82 R15.2
  Bottom 0.254: v19.41,22.97 24.79,22.95 24.94,23.11 28.94,23.14 30.2,24.41 31.68,24.43 v32.31,24.44 | v38.92,23.2 42.99,21.59 U$1.6
TPOUT+  (via drill 0.6)
  Top 0.254: IC1.51 20.66,26.91 v21.25,28.38 | v32.34,25.87 34.77,25.19 v34.77,24.78 | v52.31,10.9 52.31,14.8 R17.1
  Top 0.406: U$1.1 53.77,15.28 R17.1
  Bottom 0.254: v21.25,28.38 21.84,26.14 28.15,26.2 v32.34,25.87 | v34.77,24.78 36.23,24.19 36.24,10.78 37.84,9.12 52.21,9.13 v52.31,10.9
TPOUT-  (via drill 0.6)
  Top 0.254: IC1.50 21.14,26.76 21.39,27.29 22.38,27.61 22.38,28.12 v22.52,28.16 | v35.62,26.2 34.2,26.2 v32.11,28.58
  Top 0.406: U$1.2 61.34,8.61 R18.1
  Bottom 0.254: v22.52,28.16 27.86,28.27 27.9,28.31 v32.11,28.58 | U$1.2 57.75,16.55 56.45,17.86 38.11,17.86 37.19,18.77 37.19,25.17 36.8,25.55 36.27,25.55 v35.62,26.2
V+
  Top 0.406: 57.34,33.83 Z1.C
  Top 0.61: U$1.9 58.8,25.92 57.34,27.38 57.34,33.83

### Text on the board
tNames: www.vscp.org | Power | Act | Eth | Zeus rev C